# EAGLE design front_gap_sensor (EAGLE 9.6.1)
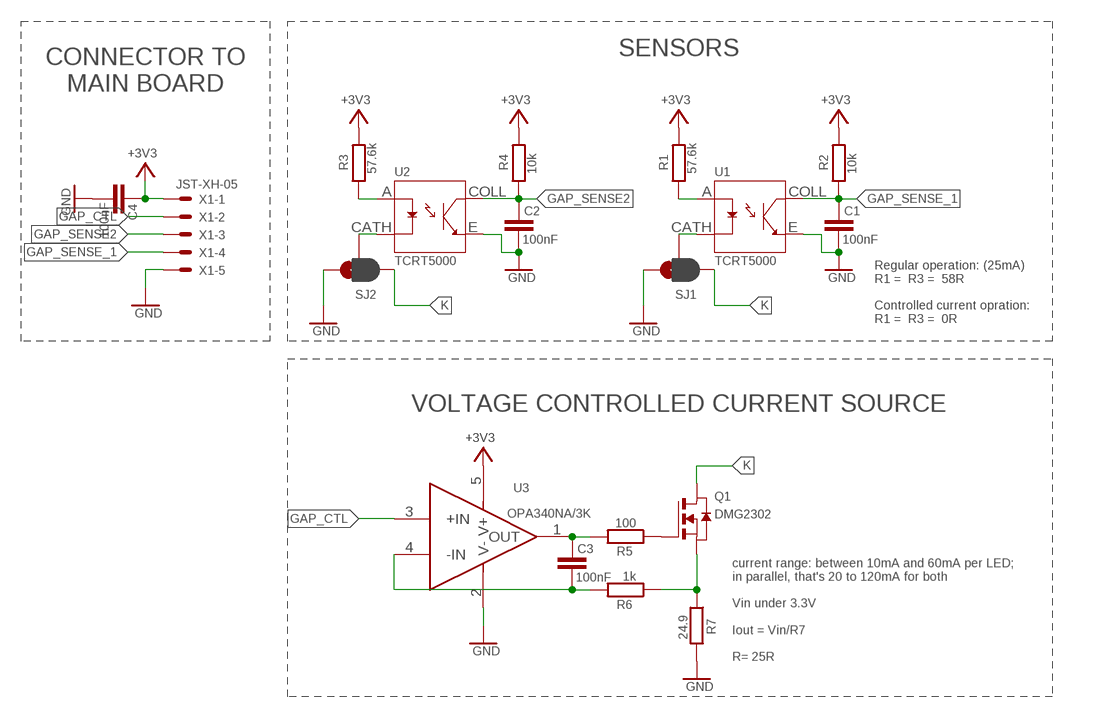
[diagram p0: schematic, sheet 1]

## Parts
C1  100nF  C-EUC0402  [C0402]
C2  100nF  C-EUC0402  [C0402]
C3  100nF  C-EUC0402  [C0402]
C4  100nF  C-EUC0402  [C0402]
Q1  DMG2302  NMOS-SOT23  [SOT-23]
R1  57.6k  R-EU_R0402  [R0402]
R2  10k  R-EU_R0402  [R0402]
R3  57.6k  R-EU_R0402  [R0402]
R4  10k  R-EU_R0402  [R0402]
R5  100  R-EU_R0402  [R0402]
R6  1k  R-EU_R0402  [R0402]
R7  24.9  R-EU_R0402  [R0402]
SJ1  SPARKFUN-PASSIVES_JUMPER_PAD-3-1&2_NC_BY_PASTE  [SPARKFUN-PASSIVES_PAD-HUMPER-3-1&2_NC_BY_PASTE_YES_SILK_FULL_BOX]
SJ2  SPARKFUN-PASSIVES_JUMPER_PAD-3-1&2_NC_BY_PASTE  [SPARKFUN-PASSIVES_PAD-HUMPER-3-1&2_NC_BY_PASTE_YES_SILK_FULL_BOX]
U1  TCRT5000  [OPTO_TCRT5000]
U2  TCRT5000  [OPTO_TCRT5000]
U3  OPA340NA/3K  [SOT95P280X145-5N]
X1  JST-XH-05  JST-XH-05-PIN-ROUND-PAD  [JST-XH-05-PACKAGE-ROUND-PAD]

## Nets
+3V3: C4.2 R1.2 R2.2 R3.2 R4.2 U3.5(V+) X1.1
GAP_CTL: U3.3(+IN) X1.2
GAP_SENSE2: C2.2 R4.1 U2.COLL X1.3
GAP_SENSE_1: C1.2 R2.1 U1.COLL X1.4
GND: C1.1 C2.1 C4.1 R7.2 SJ1.3 SJ2.3 U1.E U2.E U3.2(V-) X1.5
K: Q1.D SJ1.1 SJ2.1
K_1: SJ2.2 U2.CATH
N$2: SJ1.2 U1.CATH
N$3: C3.2 R5.2 U3.1(OUT)
N$4: C3.1 R6.2 U3.4(-IN)
N$5: Q1.G R5.1
N$6: Q1.S R6.1 R7.1
S_IN1: R3.1 U2.A
S_IN2: R1.1 U1.A

## Notes on the sheet
- SENSORS
- CONNECTOR TO
  MAIN BOARD
- Regular operation: (25mA)
  R1 =  R3 =  58R
  
  Controlled current opration: 
  R1 =  R3 =  0R
- VOLTAGE CONTROLLED CURRENT SOURCE
- current range: between 10mA and 60mA per LED; 
  in parallel, that's 20 to 120mA for both
  
  Vin under 3.3V
  
  Iout = Vin/R7
  
  R= 25R

## Library data of the parts
C1-C4 = rcl:C-EU: CAPACITOR, European symbol; SPICEPREFIX: C
Q1 = MOSFET:NMOS: N-Channel MOSFET
R1-R7 = rcl:R-EU_: RESISTOR, European symbol; SPICEPREFIX: R
SJ1 SJ2 = SparkFun_MPU-9250_Breakout:SPARKFUN-PASSIVES_JUMPER_PAD-3-1&2_NC_BY_PASTE
U1 U2 = TCRT5000:TCRT5000: 950 nm 60 mA Through Hole Reflective Optical Sensor with Transistor Output; AVAILABILITY: Unavailable; DESCRIPTION: Reflective Optical Sensor 0.591 _15mm_ PCB Mount; MF: Vishay; MP: TCRT5000; PACKAGE: PCB Mount Vishay; PRICE: None
U3 = OPA340NA_3K:OPA340NA/3K: SINGLE-SUPPLY RAIL-TO-RAIL OPERATIONAL AMPLIFIERS; AVAILABILITY: Unavailable; DESCRIPTION: General Purpose Amplifier 1 Circuit Rail-to-Rail SOT-23-5; MF: Texas Instruments; MP: OPA340NA/3K; PACKAGE: SOT-23-5 Texas Instruments; PRICE: None
X1 = con-jst-xh:JST-XH-05-PIN: JST XH Connector 2 Pin Wire to board connector. Pitch: 2,54 mm, (0.100") Number of pins: 5 Created by Rembrandt Electronics www.rembrandtelectronics.com

## Board
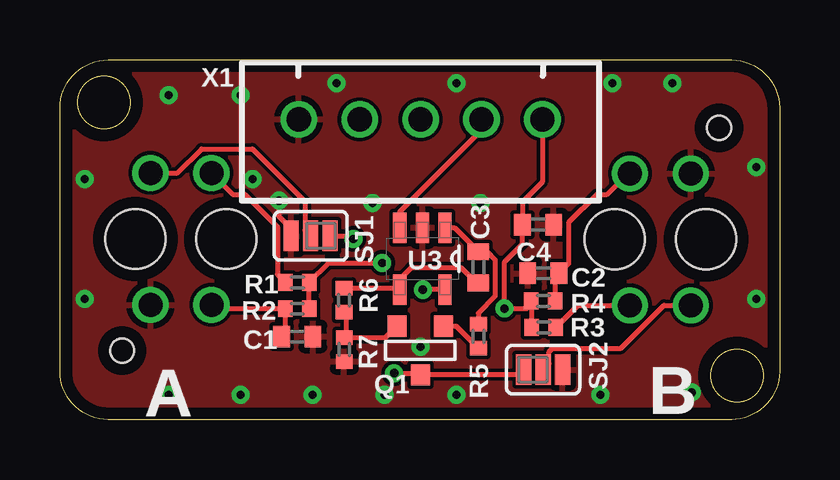
[diagram p1: board, top side]
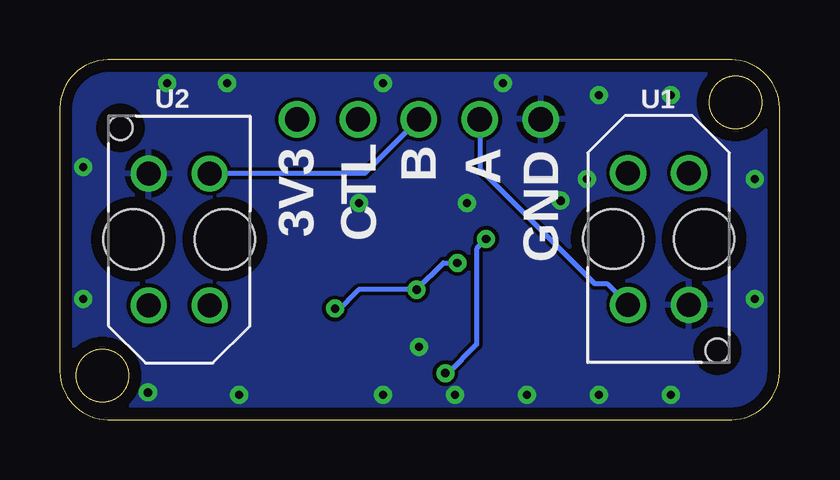
[diagram p2: board, bottom side, seen from below]

Size 30 x 15 mm. Coordinates in mm from the lower left corner, seen from the top.
Outline: 30,13 30,2 arc-90 28,0 2,0 arc-90 0,2 0,13 arc-90 2,15 28,15 arc-90 30,13
Outline: circle at 28.23,1.83 radius 1.1
Outline: circle at 1.83,13.23 radius 1.1
Copper layers (1*16): Top 0.035mm / dielectric 0.73mm / Bottom 0.035mm
Design rules "default *": minimum track width 6mil, minimum drill 0.35mm, track to track 6mil, track to pad 6mil, pad to pad 6mil, via to via 6mil, smd to smd 6mil, copper to edge 20mil, drill to drill 6mil, minimum pad ring 10mil, minimum via ring 8mil, stop-mask expansion 4mil, vias tented up to drill 0.4mm, thermal gap 10mil

### Footprints (pad centres in the part's own frame; a part is rotated, then mirrored left to right if it is on the bottom)
C0402 = smd 0.7 x 0.9: 1 -0.65,0; 2 0.65,0
SOT-23 = smd 0.787 x 0.889: D 0,1.016; G -0.965,-1.016; S 0.965,-1.016
R0402 = smd 0.6 x 0.7: 1 -0.5,0; 2 0.5,0
SPARKFUN-PASSIVES_PAD-HUMPER-3-1&2_NC_BY_PASTE_YES_SILK_FULL_BOX = smd 0.635 x 1.27: 1 -0.813,0; 2 0,0; 3 0.813,0
OPTO_TCRT5000 = drill 1 pad 1.5: A 2.75,1.27; CATH 2.75,-1.27; COLL -2.75,1.27; E -2.75,-1.27 | hole 1: -4.65,-2.45 | hole 2.5: 0,-1.9; 0,1.9
SOT95P280X145-5N = smd 1.27 x 0.559: 1 -1.295,0.94; 2 -1.295,0; 3 -1.295,-0.94; 4 1.295,-0.94; 5 1.295,0.94
JST-XH-05-PACKAGE-ROUND-PAD = drill 1.016: 1 -5.08,0; 2 -2.54,0; 3 0,0; 4 2.54,0; 5 5.08,0

### Placement (x,y rotation side)
C1  9.89,3.46 180 top
C2  20.15,6.1 0 top
C3  17.44,6.35 90 top
C4  19.93,8.13 180 top
Q1  15.02,2.88 180 top
R1  9.9,5.72 0 top
R2  9.89,4.62 0 top
R3  20.17,3.84 180 top
R4  20.15,4.94 180 top
R5  17.44,3.47 90 top
R6  11.84,4.98 90 top
R7  11.85,2.92 270 top
SJ1  10.45,7.66 180 top
SJ2  20.14,2.08 0 top
U1  5.04,7.53 90 bottom
U2  25.03,7.51 270 bottom
U3  15.11,6.71 270 top
X1  15.03,12.52 180 top

### Tracks (layer width: path | path; a pad name or v marks a point on that pad's centre or on a via)
+3V3  (via drill 0.35)
  Top 0.2: R2.2 10.39,5.63 | 10.39,5.63 R1.2 11.19,6.53 v13.43,6.53 | 10.39,5.63 R1.2 | U3.5 v15.13,5.42 | R4.2 19.65,4.83 | 19.65,4.83 19.65,3.86 R3.2 | 19.65,4.83 19.45,4.63 v18.53,4.63 18.53,6.58 19.28,7.33 C4.2 19.28,9.08 20.11,9.91 X1.1
  Bottom 0.2: v13.43,6.53 14.02,6.53 v15.13,5.42 17.55,5.42 18.43,4.53 v18.53,4.63
GAP_CTL
  Top 0.2: U3.3 14.17,8.67 17.57,12.07 X1.2
GAP_SENSE2
  Top 0.2: R4.1 20.65,5.95 C2.2 21.2,6.5 21.2,8.21 22.36,9.37 22.77,9.37 23.66,10.26 U2.COLL
  Bottom 0.2: X1.3 17.29,10.26 U2.COLL
GAP_SENSE_1
  Top 0.2: C1.2 9.39,3.61 R2.1 6.47,4.62 U1.COLL
  Bottom 0.2: U1.COLL 7.2,5.68 7.71,5.68 12.49,10.46 X1.4
GND  (via drill 0.35)
  Top 0.2: SJ1.3 9.42,7.88 9.42,8.18 9.13,8.47 v9.13,9.13
  other vias: 4.53,1.03 7.53,1.03 10.53,1.03 13.53,1.03 16.53,1.03 22.53,1.03 26.33,1.13 15.03,3.03 8.03,10.03 4.53,13.53 7.53,13.53 1.03,10.03 1.03,5.03 29.03,10.53 29.03,5.03 25.53,14.03 23.03,14.03 16.53,14.03 11.53,14.03 13.03,9.03 17.53,9.03
  pour Bottom: -0.07,15.33 30.23,15.33 30.23,-0.27 -0.07,-0.27
  pour Top: -0.37,15.33 30.23,15.33 30.23,-0.07 -0.37,-0.07
K  (via drill 0.35)
  Top 0.2: SJ1.1 12.1,7.66 v12.23,7.53 | v13.93,1.93 14.96,1.93 Q1.D 19.11,1.87 SJ2.1
  Bottom 0.2: v12.23,7.53 12.63,7.13 12.63,3.13 13.83,1.93 v13.93,1.93
K_1
  Top 0.2: SJ2.2 20.39,2.33 20.39,2.82 20.53,2.97 23.39,2.97 25.19,4.76 U2.CATH
N$2
  Top 0.2: SJ1.2 10.21,7.91 10.21,9.1 8.02,11.29 5.9,11.29 4.89,10.28 U1.CATH
N$3
  Top 0.2: U3.1 16.44,8.01 C3.2 17.8,7 18.14,6.66 18.14,5.15 17.44,4.45 R5.2
N$4
  Top 0.2: R6.2 14.11,5.48 U3.4 14.17,5.87 14.63,6.33 16.73,6.33 17.36,5.7 C3.1
N$5
  Top 0.2: Q1.G 16.52,3.9 R5.1
N$6
  Top 0.2: Q1.S 13.58,3.42 11.93,3.42 | R7.1 11.93,3.42 | R6.1 11.93,4.39 11.93,3.42
S_IN1
  Top 0.2: R3.1 21.59,4.76 U2.A
S_IN2
  Top 0.2: U1.A 7.2,9.39 7.71,9.39 9.07,8.03 9.07,6.06 R1.1

### Text on the board
tPlace: A | B
bPlace: GND | A | B | CTL | 3V3